# EAGLE design 2TE_Drossel_asymetrisch (EAGLE 5.04)
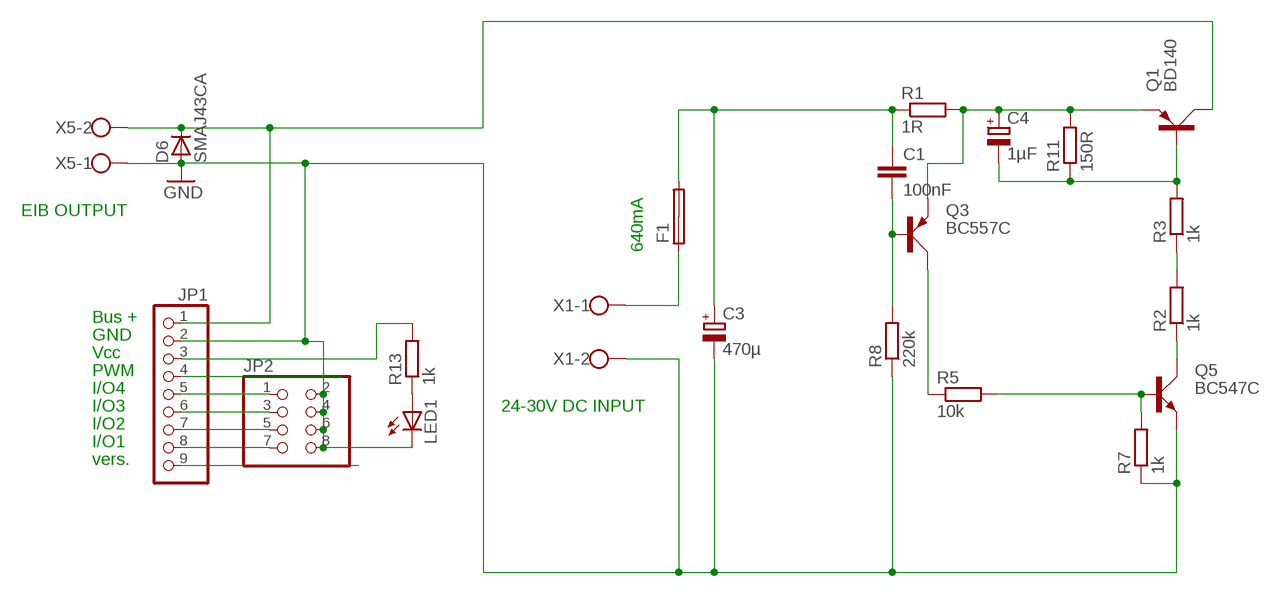
[diagram p0: schematic, sheet 1]

## Parts
C1  100nF  C-EU050-024X044  [C050-024X044]
C3  470µ  CPOL-EUE3.5-8  [E3,5-8]
C4  1µF  CPOL-EUE2.5-5  [E2,5-5]
D6  SMAJ43CA  D-SMB  [SMB]
F1  SHK20L  [SHK20L]
JP1  PINHD-1X9  [1X09]
JP2  PINHD-2X4  [2X04]
LED1  LED3MM  [LED3MM]
Q1  BD140  [TO126AV]
Q3  BC557C  BC557  [SOT54A]
Q5  BC547C  BC547  [SOT54A]
R1  1R  R-EU_0207/10  [0207/10]
R2  1k  R-EU_0207/10  [0207/10]
R3  1k  R-EU_0207/10  [0207/10]
R5  10k  R-EU_0207/10  [0207/10]
R7  1k  R-EU_0207/10  [0207/10]
R8  220k  R-EU_0207/10  [0207/10]
R11  150R  R-EU_0207/10  [0207/10]
R13  1k  R-EU_0207/10  [0207/10]
X1  W237-02P  [W237-132]
X5  W237-02P  [W237-132]

## Nets
+15V: C1.1 C3.+ F1.2A R1.1
GND: C3.- D6.2(A) JP1.2 JP2.2 JP2.4 JP2.6 JP2.8 LED1.K(C) Q5.E R7.1 R8.1 X1.2 X5.1
IO1: JP1.8 JP2.7
IO2: JP1.7 JP2.5
IO3: JP1.6 JP2.3
IO4: JP1.5 JP2.1
N$1: C4.+ Q1.E Q3.E R1.2 R11.2
N$2: R2.2 R3.1
N$3: JP1.9
N$4: LED1.A R13.1
N$5: Q5.C R2.1
N$6: F1.1A X1.1
N$7: C1.2 Q3.B R8.2
N$9: Q5.B R5.2 R7.2
N$11: C4.- Q1.B R3.2 R11.1
N$12: JP1.4
N$14: Q3.C R5.1
N$15: JP1.3 R13.2
V+: D6.1(C) JP1.1 Q1.C X5.2
Unconnected: F1.1B F1.2B

## Notes on the sheet
- EIB OUTPUT
- 640mA
- Bus +
- GND
- Vcc
- PWM
- I/O4
- I/O3 | 24-30V DC INPUT
- I/O2
- I/O1
- vers.

## Library data of the parts
C1 = rcl:C-EU: CAPACITOR, European symbol
C3 C4 = rcl:CPOL-EU: POLARIZED CAPACITOR, European symbol
D6 = semicon-smd-ipc:D-: DIODE unfilled
F1 = fuse:SHK20L: FUSE HOLDER 5 x 20 mm, SH contact, SHH1 Schukat, E1073 Buerklin
JP1 = pinhead:PINHD-1X9: PIN HEADER
JP2 = pinhead:PINHD-2X4: PIN HEADER
LED1 = led:LED: LED OSRAM: - CHIPLED LG R971, LG N971, LY N971, LG Q971, LY Q971, LO R971, LY R971 LH N974, LH R974 LS Q976, LO Q976, LY Q976 LO Q996 - Hyper CHIPLED LW Q18S LB Q993, LB Q99A, LB R99A - SideLED LS A670, LO A670, LY A670, LG A670, LP A670 LB A673, LV A673, LT A673, LW A673 LH A674 LY A675 LS A676, LA A676, LO A676, LY A676, LW A676 LS A679, LY A679, LG A679 - Hyper Micro SIDELED® LS Y876, LA Y876, LO Y876, LY Y876 LT Y87S - SmartLED LW L88C, LW L88S LB L89C, LB L89S, LG L890 LS L89K, LO L89K, LY L89K LS L896, LA L896, LO L896, LY L896 - TOPLED LS T670, LO T670, LY T670, LG T670, LP T670 LSG T670, LSP T670, LSY T670, LOP T670, LYG T670 LG T671, LOG T671, LSG T671 LB T673, LV T673, LT T673, LW T673 LH T674 LS T676, LA T676, LO T676, LY T676, LB T676, LH T676, LSB T676, LW T676 LB T67C, LV T67C, LT T67C, LS T67K, LO T67K, LY T67K, LW E67C LS E67B, LA E67B, LO E67B, LY E67B, LB E67C, LV E67C, LT E67C LW T67C LS T679, LY T679, LG T679 LS T770, LO T770, LY T770, LG T770, LP T770 LB T773, LV T773, LT T773, LW T773 LH T774 LS E675, LA E675, LY E675, LS T675 LS T776, LA T776, LO T776, LY T776, LB T776 LHGB T686 LT T68C, LB T68C - Hyper Mini TOPLED® LB M676 - Mini TOPLED Santana® LG M470 LS M47K, LO M47K, LY M47K Source: http://www.osram.convergy.de - LUMILED® LXK2-PW12-R00, LXK2-PW12-S00, LXK2-PW14-U00, LXK2-PW14-V00 LXK2-PM12-R00, LXK2-PM12-S00, LXK2-PM14-U00 LXK2-PE12-Q00, LXK2-PE12-R00, LXK2-PE12-S00, LXK2-PE14-T00, LXK2-PE14-U00 LXK2-PB12-K00, LXK2-PB12-L00, LXK2-PB12-M00, LXK2-PB14-N00, LXK2-PB14-P00, LXK2-PB14-Q00 LXK2-PR12-L00, LXK2-PR12-M00, LXK2-PR14-Q00, LXK2-PR14-R00 LXK2-PD12-Q00, LXK2-PD12-R00, LXK2-PD12-S00 LXK2-PH12-R00, LXK2-PH12-S00 LXK2-PL12-P00, LXK2-PL12-Q00, LXK2-PL12-R00 Source: www.luxeon.com
Q1 = transistor-power:BD140: PNP TRANSISTOR
Q3 = transistor-small-signal:BC557: PNP TRANSISTOR
Q5 = transistor-small-signal:BC547: NPN TRANSISTOR
R1-R3 R5 R7 R8 R11 R13 = rcl:R-EU_: RESISTOR, European symbol
X1 X5 = con-wago-508:W237-02P: WAGO SREW CLAMP

## Board
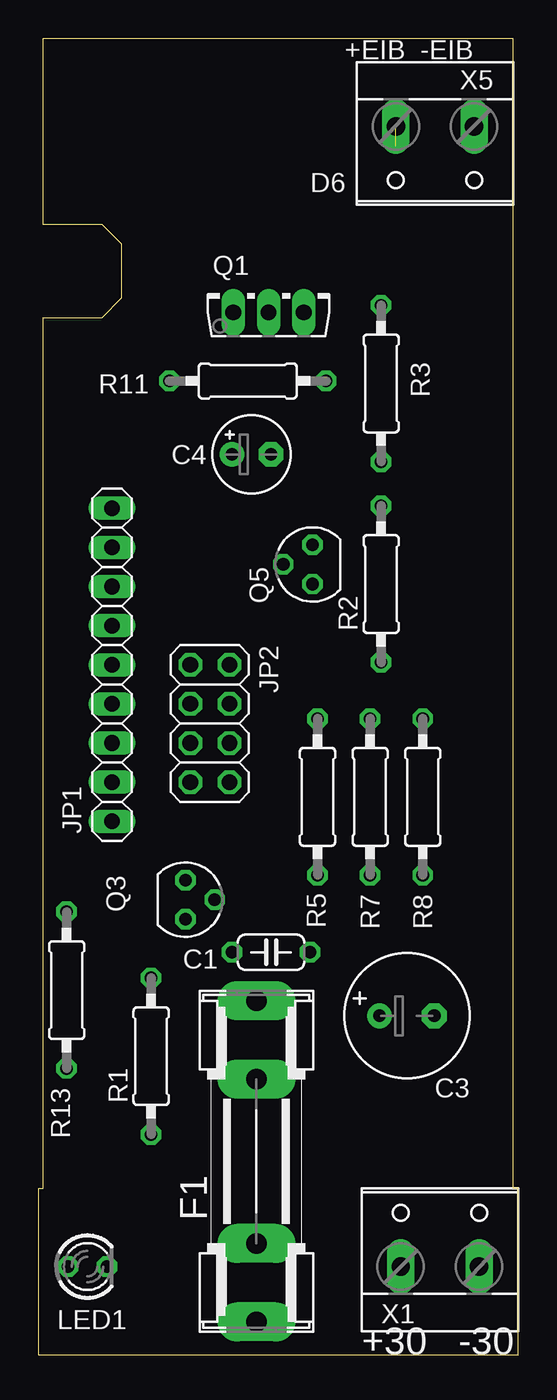
[diagram p1: board, top side]
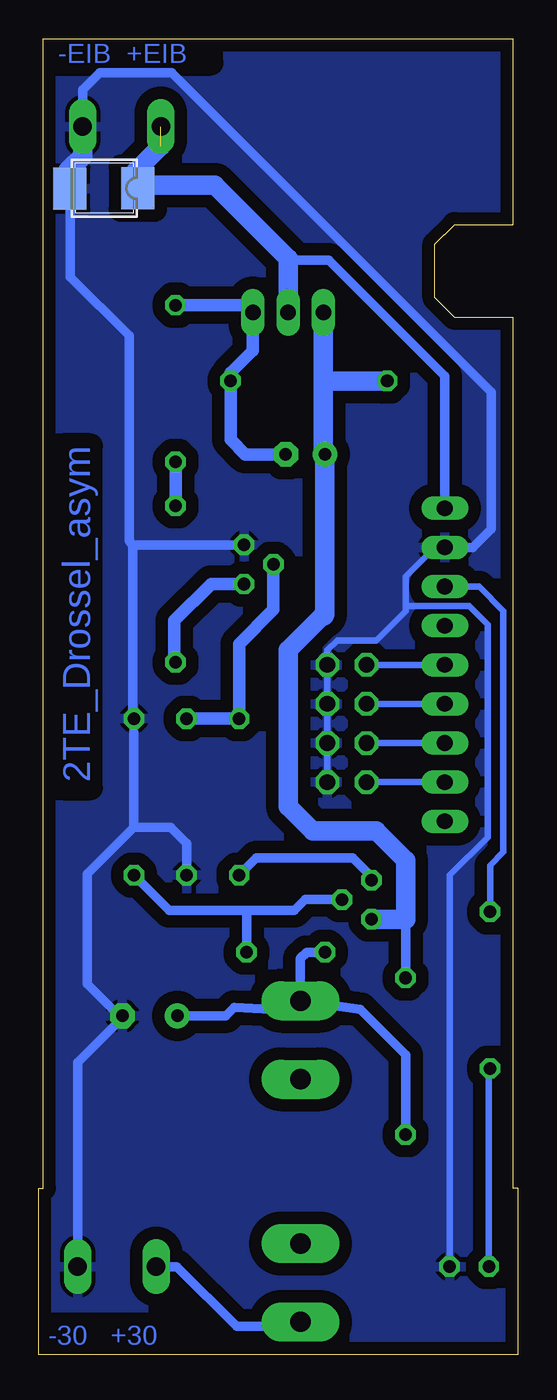
[diagram p2: board, bottom side, seen from below]

Size 31.11 x 85.41 mm. Coordinates in mm from the lower left corner, seen from the top.
Outline: 0,0 0,10.79 0.32,10.79 0.32,67.31 4.13,67.31 5.4,68.58 5.4,72.07 4.13,73.34 0.32,73.34 0.32,85.41 30.8,85.41 30.8,10.79 31.11,10.79 31.11,0 0,0
Copper layers (1*16): Top 0.035mm / dielectric 1.5mm / Bottom 0.035mm
Design rules "default *": minimum track width 10mil, minimum drill 24mil, track to track 12mil, track to pad 12mil, pad to pad 12mil, via to via 12mil, smd to smd 8mil, copper to edge 12mil, drill to drill 8mil, minimum pad ring 10mil, minimum via ring 8mil, stop-mask expansion 4mil, vias tented up to drill 0mil, thermal gap 10mil

### Footprints (pad centres in the part's own frame; a part is rotated, then mirrored left to right if it is on the bottom)
C050-024X044 = drill 0.813 octagon: 1 -2.54,0; 2 2.54,0
E3,5-8 = drill 0.813 pad 1.6 round: + -1.778,0 | drill 0.813 pad 1.6 octagon: - 1.778,0
E2,5-5 = drill 0.813 pad 1.6 round: + -1.27,0 | drill 0.813 pad 1.6 octagon: - 1.27,0
SMB = smd 2.159 x 2.743: 1 -2.311,-0.127; 2 2.108,-0.102
SHK20L = drill 1.321 pad 2.54 long: 1A -10.414,0; 1B -5.334,0; 2A 10.414,0; 2B 5.334,0
1X09 = drill 1.016 long: 1 -10.16,0; 2 -7.62,0; 3 -5.08,0; 4 -2.54,0; 5 0,0; 6 2.54,0; 7 5.08,0; 8 7.62,0; 9 10.16,0
2X04 = drill 1.016 octagon: 1 -3.81,-1.27; 2 -3.81,1.27; 3 -1.27,-1.27; 4 -1.27,1.27; 5 1.27,-1.27; 6 1.27,1.27; 7 3.81,-1.27; 8 3.81,1.27
LED3MM = drill 0.813 octagon: A -1.27,0; K 1.27,0
TO126AV = drill 1.016 long: B 2.286,-1.27; C 0,-1.27; E -2.286,-1.27
SOT54A = drill 0.813 octagon: B 0,1.905; C -1.27,0; E 1.27,0
0207/10 = drill 0.813 octagon: 1 -5.08,0; 2 5.08,0
W237-132 = drill 1.194 long: 1 -2.54,-0.635; 2 2.54,-0.635

### Placement (x,y rotation side)
C1  15.08,26.11 0 top
C3  23.89,21.99 0 top
C4  13.81,58.42 0 top
D6  26.99,75.56 180 bottom
F1  14.13,12.54 90 top
JP1  4.76,44.77 270 top
JP2  11.11,40.96 270 top
LED1  3.17,5.71 0 top
Q1  14.92,68.9 0 top
Q3  9.53,29.53 270 top
Q5  17.78,51.28 90 top
R1  7.3,19.37 90 top
R2  22.22,50.01 90 top
R3  22.22,63.02 90 top
R5  18.1,36.2 90 top
R7  21.51,36.2 90 top
R8  24.92,36.2 270 top
R11  13.57,63.18 180 top
R13  1.83,23.65 90 top
X1  26.04,6.35 0 top
X5  25.72,79.06 180 top

### Tracks (layer width: path | path; a pad name or v marks a point on that pad's centre or on a via)
+15V
  Bottom 0.61: F1.2A 14.05,22.48 | F1.2A 10.26,22.4 7.3,19.45 R1.1 | C3.+ 18.97,21.99 18.42,22.54 14.19,22.3 F1.2A | C1.1 13.73,26.11 14.13,25.72 F1.2A
GND
  Bottom 0.406: JP2.8 JP2.6 JP2.4 JP2.2 12.38,45.72 11.75,46.35 9.21,46.35 7.3,48.26 7.3,48.58 | 7.3,48.58 7.3,50.48 5.4,52.39 JP1.2 | LED1.K 4.45,31.11 1.98,33.58 1.98,47.39 3.17,48.58 7.3,48.58
  Bottom 0.61: JP1.2 2.94,52.39 1.75,53.58 1.75,62.47 22.46,83.19 27.15,83.19 28.26,82.07 X5.1 | D6.2 29.05,75.62 29.05,69.93 25.24,66.12 25.24,52.78 25,52.55 | 25,52.55 Q5.E | 28.58,5.64 28.58,18.97 25.72,21.83 27.94,24.05 27.94,31.19 24.92,34.21 | 24.92,34.21 24.92,40.4 | R7.1 21.51,33.18 22.54,34.21 24.92,34.21 | 25,50.09 25,49.61 25,41.35 R8.1 | 25,50.09 25,49.69 | 25,50.09 25,52.47 25,52.55
  Bottom 1.27: X5.1 28.26,77.79 29.21,76.83 29.21,75.56 29.11,75.67 D6.2
  pour Bottom (isolate 0.813): -0.4,85.96 -0.4,-0.48 31.35,-0.48 31.35,85.96 1.67,85.96
IO1
  Bottom 0.406: JP1.8 JP2.7
IO2
  Bottom 0.406: JP1.7 JP2.5
IO3
  Bottom 0.406: JP1.6 JP2.3
IO4
  Bottom 0.406: JP1.5 JP2.1
N$1
  Bottom 0.61: R1.2 7.3,28.1 7.46,28.26
  Bottom 1.27: Q3.E 7.46,28.26 7.3,28.26 7.3,32.07 9.21,33.97 13.34,33.97 14.92,35.56 14.92,45.72 12.7,47.94 12.62,47.94 12.54,48.02 C4.+ 12.64,58.52 12.64,63.1 | 12.64,63.1 Q1.E | R11.2 12.56,63.18 12.64,63.1
N$2
  Bottom 0.813: R2.2 R3.1
N$4
  Bottom 0.406: LED1.A 1.9,18.49 R13.1
N$5
  Bottom 0.813: Q5.C 19.92,50.01 22.3,47.62 22.3,45.01 R2.1
N$6
  Bottom 0.61: X1.1 22.15,5.71 18.26,1.83 14.38,1.83 F1.1A
N$7
  Bottom 0.61: C1.2 | Q3.B 13.81,29.53 14.53,28.81 17.54,28.81 | 17.54,28.81 22.62,28.81 R8.2 | C1.2 17.62,28.73 17.54,28.81
N$9
  Bottom 0.813: R7.2 R5.2 18.1,46.12 15.87,48.34 Q5.B
N$11
  Bottom 0.813: R3.2 17.68,68.1 Q1.B 17.22,67.61 17.22,65.17 18.65,63.74 R11.1 18.65,59.37 17.7,58.42 C4.-
N$14
  Bottom 0.61: Q3.C 9.52,31.04 10.72,32.23 16.99,32.23 R5.1
N$15
  Bottom 0.406: R13.2 1.83,31.75 0.95,32.62 0.95,48.26 2.54,49.85 JP1.3
V+  (1 unrouted)
  Bottom 0.406: 24.45,75.56 24.68,75.48 D6.1
  Bottom 0.61: JP1.1 4.76,63.5 12.3,71.04 14.84,71.04 14.92,70.96
  Bottom 1.27: Q1.C 14.92,70.96 14.92,71.12 19.68,75.88 24.77,75.88 | 24.77,75.88 24.68,75.79 D6.1 24.57,75.69 24.45,75.56 24.77,75.88 | 23.18,78.42 24.77,76.83 24.77,75.88

### Text on the board
Bottom: -EIB +EIB | 2TE_Drossel_asym | -30 +30
tPlace: +EIB -EIB | +30 -30